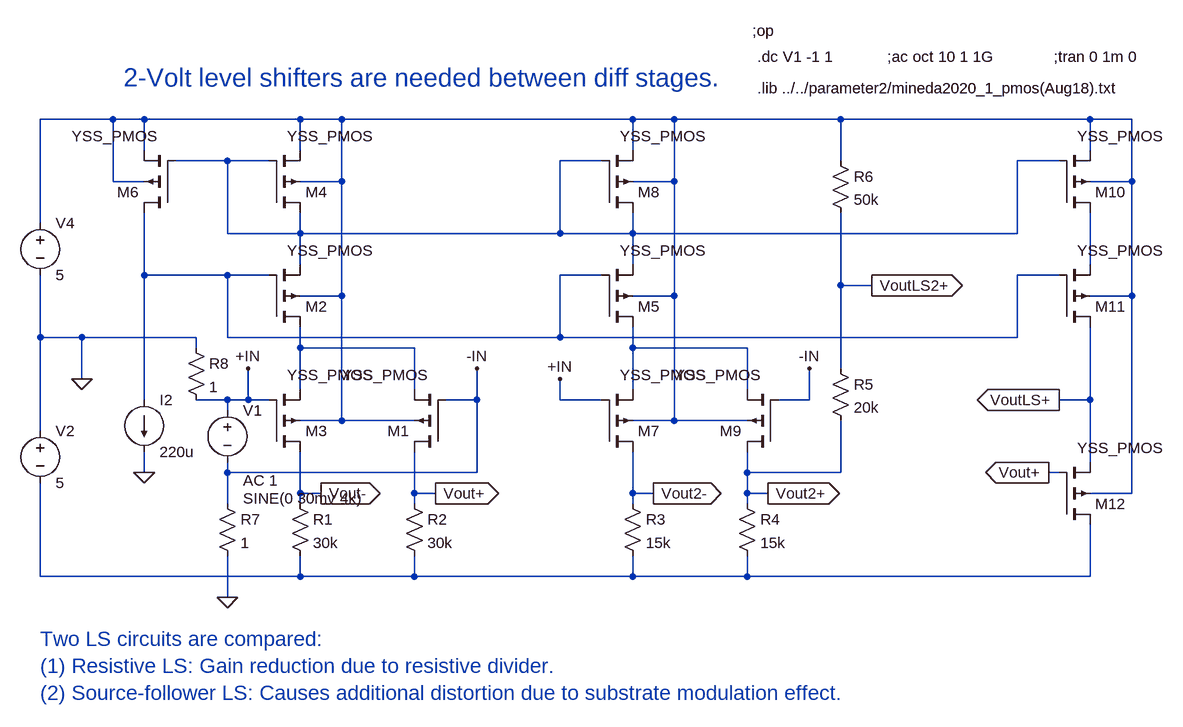
[diagram p0: schematic LevelShifter-test14umS.asc]
LevelShifter-test14umS.asc, the LTspice schematic file:
Version 4
SHEET 1 2296 2968
WIRE -400 -384 -512 -384
WIRE -352 -384 -400 -384
WIRE -112 -384 -352 -384
WIRE -48 -384 -112 -384
WIRE 400 -384 -48 -384
WIRE 464 -384 400 -384
WIRE 720 -384 464 -384
WIRE 1104 -384 720 -384
WIRE 1168 -384 1104 -384
WIRE -352 -336 -352 -384
WIRE -112 -336 -112 -384
WIRE 400 -336 400 -384
WIRE 1104 -336 1104 -384
WIRE -224 -320 -304 -320
WIRE -160 -320 -224 -320
WIRE 352 -320 288 -320
WIRE 720 -320 720 -384
WIRE 1056 -320 992 -320
WIRE -400 -288 -400 -384
WIRE -352 -288 -400 -288
WIRE -48 -288 -48 -384
WIRE -48 -288 -112 -288
WIRE 464 -288 464 -384
WIRE 464 -288 400 -288
WIRE 1168 -288 1168 -384
WIRE 1168 -288 1104 -288
WIRE -512 -224 -512 -384
WIRE -224 -208 -224 -320
WIRE -112 -208 -112 -240
WIRE -112 -208 -224 -208
WIRE 288 -208 288 -320
WIRE 288 -208 -112 -208
WIRE 400 -208 400 -240
WIRE 400 -208 288 -208
WIRE 992 -208 992 -320
WIRE 992 -208 400 -208
WIRE -112 -160 -112 -208
WIRE 400 -160 400 -208
WIRE 1104 -160 1104 -240
WIRE -352 -144 -352 -240
WIRE -224 -144 -352 -144
WIRE -160 -144 -224 -144
WIRE 352 -144 288 -144
WIRE 1056 -144 992 -144
WIRE 720 -128 720 -240
WIRE 768 -128 720 -128
WIRE -48 -112 -48 -288
WIRE -48 -112 -112 -112
WIRE 464 -112 464 -288
WIRE 464 -112 400 -112
WIRE 1168 -112 1168 -288
WIRE 1168 -112 1104 -112
WIRE -512 -48 -512 -144
WIRE -448 -48 -512 -48
WIRE -272 -48 -448 -48
WIRE -224 -48 -224 -144
WIRE 288 -48 288 -144
WIRE 288 -48 -224 -48
WIRE 992 -48 992 -144
WIRE 992 -48 288 -48
WIRE -272 -32 -272 -48
WIRE -112 -32 -112 -64
WIRE 64 -32 -112 -32
WIRE 400 -32 400 -64
WIRE 576 -32 400 -32
WIRE 720 0 720 -128
WIRE -448 16 -448 -48
WIRE -112 32 -112 -32
WIRE 64 32 64 -32
WIRE 400 32 400 -32
WIRE 576 32 576 -32
WIRE -352 48 -352 -144
WIRE -224 48 -272 48
WIRE -192 48 -192 0
WIRE -192 48 -224 48
WIRE -160 48 -192 48
WIRE 160 48 160 0
WIRE 160 48 112 48
WIRE 288 48 288 16
WIRE 352 48 288 48
WIRE 672 48 672 0
WIRE 672 48 624 48
WIRE 1104 48 1104 -64
WIRE 1104 48 1056 48
WIRE -224 64 -224 48
WIRE -48 80 -48 -112
WIRE -48 80 -112 80
WIRE 64 80 -48 80
WIRE 464 80 464 -112
WIRE 464 80 400 80
WIRE 576 80 464 80
WIRE -512 96 -512 -48
WIRE 1104 144 1104 48
WIRE -352 160 -352 128
WIRE -224 160 -224 144
WIRE 160 160 160 48
WIRE 160 160 -224 160
WIRE 576 160 576 128
WIRE 720 160 720 80
WIRE 720 160 576 160
WIRE 1056 160 1040 160
WIRE -112 192 -112 128
WIRE -80 192 -112 192
WIRE 64 192 64 128
WIRE 96 192 64 192
WIRE 400 192 400 128
WIRE 432 192 400 192
WIRE 576 192 576 160
WIRE 608 192 576 192
WIRE 1168 192 1168 -112
WIRE 1168 192 1104 192
WIRE -224 208 -224 160
WIRE -112 208 -112 192
WIRE 64 208 64 192
WIRE 400 208 400 192
WIRE 576 208 576 192
WIRE -512 320 -512 176
WIRE -112 320 -112 288
WIRE -112 320 -512 320
WIRE 64 320 64 288
WIRE 64 320 -112 320
WIRE 400 320 400 288
WIRE 400 320 64 320
WIRE 576 320 576 288
WIRE 576 320 400 320
WIRE 1104 320 1104 240
WIRE 1104 320 576 320
WIRE -224 352 -224 288
FLAG -80 192 Vout-
IOPIN -80 192 Out
FLAG -352 160 0
FLAG -224 352 0
FLAG 96 192 Vout+
IOPIN 96 192 Out
FLAG -448 16 0
FLAG 1056 48 VoutLS+
IOPIN 1056 48 Out
FLAG 1040 160 Vout+
IOPIN 1040 160 Out
FLAG 432 192 Vout2-
IOPIN 432 192 Out
FLAG 608 192 Vout2+
IOPIN 608 192 Out
FLAG -192 0 +IN
FLAG 160 0 -IN
FLAG 288 16 +IN
FLAG 672 0 -IN
FLAG 768 -128 VoutLS2+
IOPIN 768 -128 Out
SYMBOL pmos4 -304 -240 R180
WINDOW 3 28 118 Left 2
SYMATTR Value YSS_PMOS
SYMATTR InstName M6
SYMATTR Value2 l=14u w=280u ad=3.92n as=3.92n pd=308u ps=308u
SYMBOL current -352 48 R0
WINDOW 123 0 0 Left 2
WINDOW 39 0 0 Left 2
SYMATTR InstName I2
SYMATTR Value 220u
SYMBOL pmos4 -160 -64 M180
WINDOW 3 28 118 Left 2
SYMATTR Value YSS_PMOS
SYMATTR InstName M2
SYMATTR Value2 l=14u w=84u ad=1.176n as=1.176n pd=112u ps=112u
SYMBOL pmos4 -160 128 M180
WINDOW 3 28 118 Left 2
SYMATTR Value YSS_PMOS
SYMATTR InstName M3
SYMATTR Value2 l=10u w=200u ad=2.0n as=2.0n pd=220u ps=220u
SYMBOL res -128 192 R0
SYMATTR InstName R1
SYMATTR Value 30k
SYMBOL voltage -224 48 R0
WINDOW 3 24 152 Left 2
WINDOW 123 24 124 Left 2
WINDOW 39 0 0 Left 2
SYMATTR Value SINE(0 30mv 4k)
SYMATTR Value2 AC 1
SYMATTR InstName V1
SYMBOL voltage -512 80 R0
WINDOW 123 0 0 Left 2
WINDOW 39 0 0 Left 2
SYMATTR InstName V2
SYMATTR Value 5
SYMBOL res 48 192 R0
SYMATTR InstName R2
SYMATTR Value 30k
SYMBOL pmos4 -160 -240 M180
WINDOW 3 28 118 Left 2
SYMATTR Value YSS_PMOS
SYMATTR InstName M4
SYMATTR Value2 l=14u w=280u ad=3.92n as=3.92n pd=308u ps=308u
SYMBOL pmos4 112 128 R180
WINDOW 3 28 118 Left 2
SYMATTR Value YSS_PMOS
SYMATTR InstName M1
SYMATTR Value2 l=10u w=200u ad=2.0n as=2.0n pd=220u ps=220u
SYMBOL pmos4 1056 -240 M180
WINDOW 3 28 118 Left 2
SYMATTR Value YSS_PMOS
SYMATTR InstName M10
SYMATTR Value2 l=14u w=280u ad=3.92n as=3.92n pd=308u ps=308u
SYMBOL pmos4 1056 -64 M180
WINDOW 3 28 118 Left 2
SYMATTR Value YSS_PMOS
SYMATTR InstName M11
SYMATTR Value2 l=14u w=84u ad=1.176n as=1.176n pd=112u ps=112u
SYMBOL pmos4 1056 240 M180
WINDOW 3 28 118 Left 2
SYMATTR Value YSS_PMOS
SYMATTR InstName M12
SYMATTR Value2 l=10u w=200u ad=2.0n as=2.0n pd=220u ps=220u
SYMBOL voltage -512 -240 R0
WINDOW 123 0 0 Left 2
WINDOW 39 0 0 Left 2
SYMATTR InstName V4
SYMATTR Value 5
SYMBOL res -240 192 R0
SYMATTR InstName R7
SYMATTR Value 1
SYMBOL res -288 -48 R0
SYMATTR InstName R8
SYMATTR Value 1
SYMBOL pmos4 352 -64 M180
WINDOW 3 28 118 Left 2
SYMATTR Value YSS_PMOS
SYMATTR InstName M5
SYMATTR Value2 l=14u w=84u ad=1.176n as=1.176n pd=112u ps=112u
SYMBOL pmos4 352 128 M180
WINDOW 3 28 118 Left 2
SYMATTR Value YSS_PMOS
SYMATTR InstName M7
SYMATTR Value2 l=10u w=200u ad=2.0n as=2.0n pd=220u ps=220u
SYMBOL res 384 192 R0
SYMATTR InstName R3
SYMATTR Value 15k
SYMBOL res 560 192 R0
SYMATTR InstName R4
SYMATTR Value 15k
SYMBOL pmos4 352 -240 M180
WINDOW 3 28 118 Left 2
SYMATTR Value YSS_PMOS
SYMATTR InstName M8
SYMATTR Value2 l=14u w=280u ad=3.92n as=3.92n pd=308u ps=308u
SYMBOL pmos4 624 128 R180
WINDOW 3 28 118 Left 2
SYMATTR Value YSS_PMOS
SYMATTR InstName M9
SYMATTR Value2 l=10u w=200u ad=2.0n as=2.0n pd=220u ps=220u
SYMBOL res 704 -16 R0
SYMATTR InstName R5
SYMATTR Value 20k
SYMBOL res 704 -336 R0
SYMATTR InstName R6
SYMATTR Value 50k
TEXT 592 -480 Left 2 !.dc V1 -1 1
TEXT 592 -432 Left 2 !.lib ../../parameter2/mineda2020_1_pmos(Aug18).txt
TEXT 584 -520 Left 2 !;op
TEXT 792 -480 Left 2 !;ac oct 10 1 1G
TEXT -384 -448 Left 4 ;2-Volt level shifters are needed between diff stages.
TEXT 1048 -480 Left 2 !;tran 0 1m 0
TEXT -512 416 Left 3 ;Two LS circuits are compared:\n(1) Resistive LS: Gain reduction due to resistive divider.\n(2) Source-follower LS: Causes additional distortion due to substrate modulation effect.

The netlist it stands for:
* LevelShifter-test14umS.asc
M6 N004 N002 N001 N001 YSS_PMOS l=14u w=280u ad=3.92n as=3.92n pd=308u ps=308u
I2 N004 0 220u
M2 N005 N004 N002 N001 YSS_PMOS l=14u w=84u ad=1.176n as=1.176n pd=112u ps=112u
M3 Vout- +IN N005 N001 YSS_PMOS l=10u w=200u ad=2.0n as=2.0n pd=220u ps=220u
R1 Vout- N007 30k
V1 +IN -IN SINE(0 30mv 4k) AC 1
V2 0 N007 5
R2 Vout+ N007 30k
M4 N002 N002 N001 N001 YSS_PMOS l=14u w=280u ad=3.92n as=3.92n pd=308u ps=308u
M1 Vout+ -IN N005 N001 YSS_PMOS l=10u w=200u ad=2.0n as=2.0n pd=220u ps=220u
M10 N003 N002 N001 N001 YSS_PMOS l=14u w=280u ad=3.92n as=3.92n pd=308u ps=308u
M11 VoutLS+ N004 N003 N001 YSS_PMOS l=14u w=84u ad=1.176n as=1.176n pd=112u ps=112u
M12 N007 Vout+ VoutLS+ N001 YSS_PMOS l=10u w=200u ad=2.0n as=2.0n pd=220u ps=220u
V4 N001 0 5
R7 -IN 0 1
R8 0 +IN 1
M5 N006 N004 N002 N001 YSS_PMOS l=14u w=84u ad=1.176n as=1.176n pd=112u ps=112u
M7 Vout2- +IN N006 N001 YSS_PMOS l=10u w=200u ad=2.0n as=2.0n pd=220u ps=220u
R3 Vout2- N007 15k
R4 Vout2+ N007 15k
M8 N002 N002 N001 N001 YSS_PMOS l=14u w=280u ad=3.92n as=3.92n pd=308u ps=308u
M9 Vout2+ -IN N006 N001 YSS_PMOS l=10u w=200u ad=2.0n as=2.0n pd=220u ps=220u
R5 VoutLS2+ Vout2+ 20k
R6 N001 VoutLS2+ 50k
.model NMOS NMOS
.model PMOS PMOS
.lib standard.mos
.dc V1 -1 1
.lib ../../parameter2/mineda2020_1_pmos(Aug18).txt
;op
;ac oct 10 1 1G
* 2-Volt level shifters are needed between diff stages.
;tran 0 1m 0
* Two LS circuits are compared:
* (1) Resistive LS: Gain reduction due to resistive divider.
* (2) Source-follower LS: Causes additional distortion due to substrate modulation effect.
.backanno
.end